# Altium project ATmega-ELVIS.PrjPcb
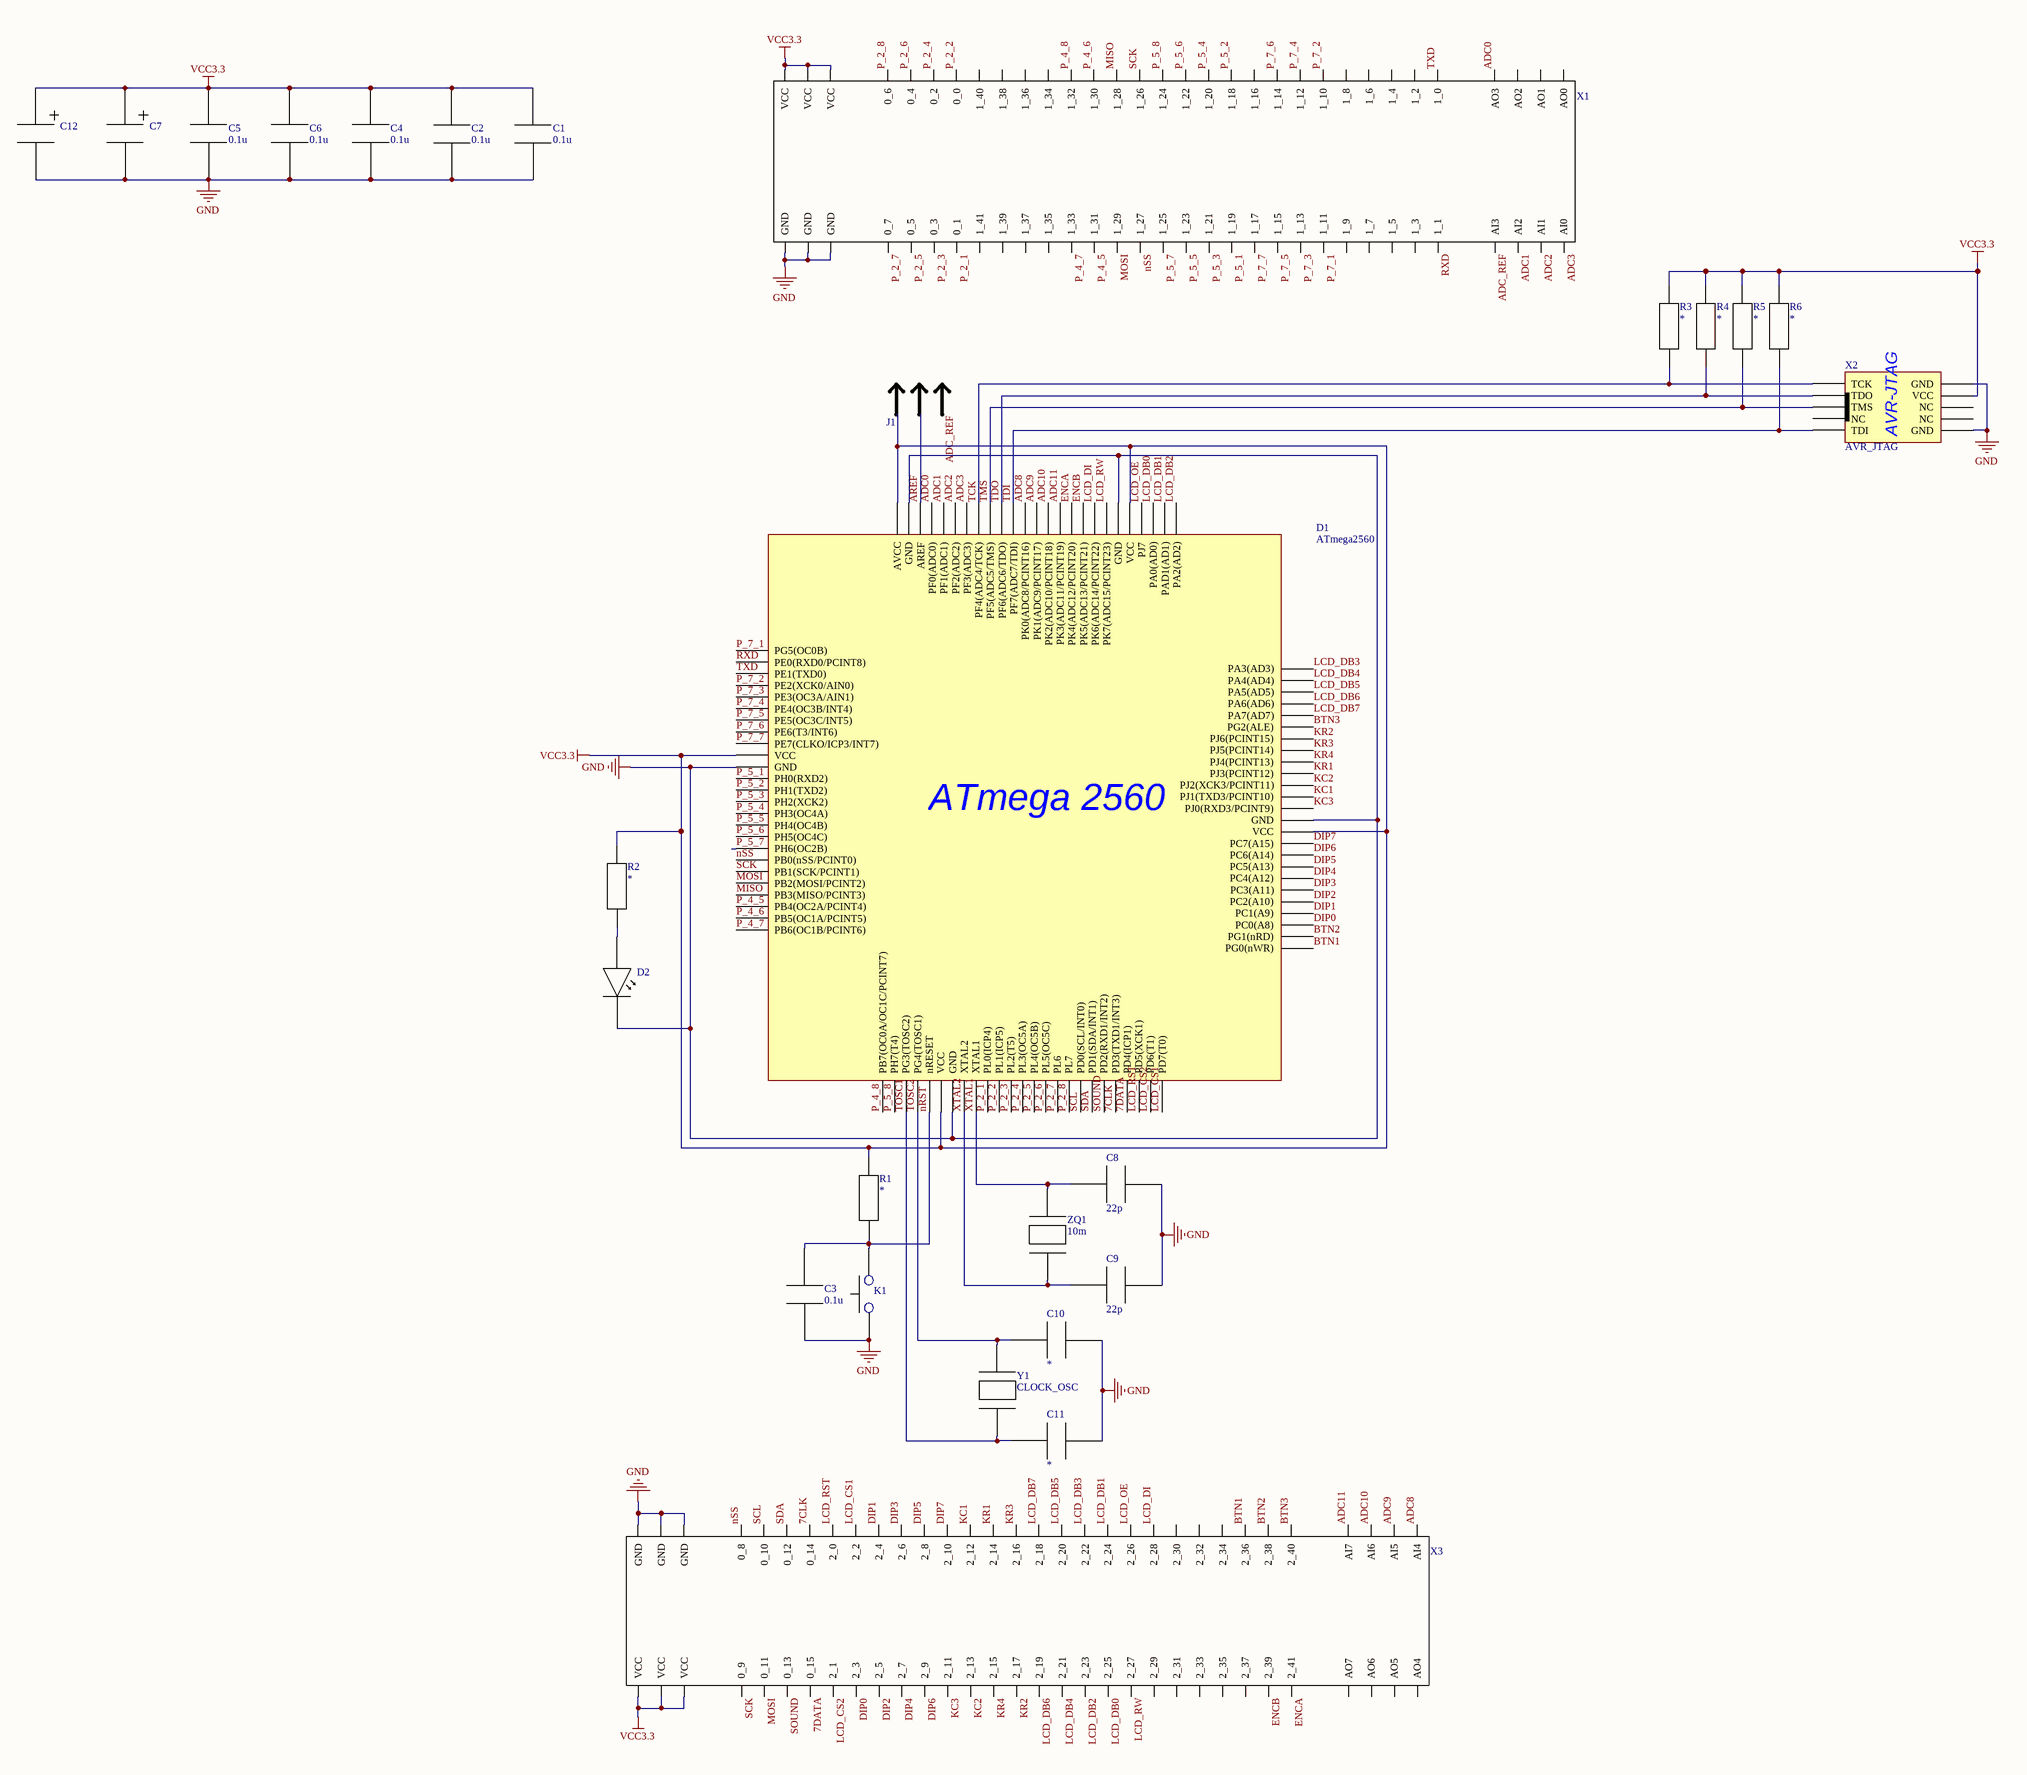
[diagram p0: main.SchDoc]
1 sheet, 27 parts. Net scope: global (net labels, ports and power ports of the same name join across sheets).
Board file: board.PcbDoc

## Sheet main.SchDoc
size A2

### Parts
C1  0.1u  [0805]
C2  0.1u  [0805]
C3  0.1u  [0805]
C4  0.1u  [0805]
C5  0.1u  [0805]
C6  0.1u  [0805]
C7  C_Ta  [C_Ta]  (value not drawn)
C8  22p  [0805]
C9  22p  [0805]
C10  *  [0805]
C11  *  [0805]
C12  C_Ta  [C_Ta]  (value not drawn)
D1  ATmega2560  [ATmega2560-16AU]
D2  LED0805  [0805]  (value not drawn)
J1  JUMPER_SWITCH_2S  [JUMPER_SWITCH_2S]  (value not drawn)
K1  SMD_BUTTON  [SMD_BUTTON]  (value not drawn)
R1  *  [0805]
R2  *  [0805]
R3  *  [0805]
R4  *  [0805]
R5  *  [0805]
R6  *  [0805]
X1  CONNECTOR_TOP  [Connector]  (value not drawn)
X2  AVR_JTAG  [JTAG_PLD]
X3  CONNECTOR_BOTTOM  [Connector]  (value not drawn)
Y1  CLOCK_OSC  [CLOCK_OSC]
ZQ1  10m  [XTAL]

### Nets
GND: C1.1 C2.1 C3.1 C4.2 C5.2 C6.2 C7.2 C8.1 C9.1 C10.1 C11.1 C12.2 D1.11(GND) D1.32(GND) D1.62(GND) D1.81(GND) D1.99(GND) D2.2 K1.1 X1.61(GND) X1.62(GND) X1.63(GND) X2.2(GND) X2.10(GND) X3.0(GND) X3.1(GND) X3.2(GND)
VCC3.3: C1.2 C2.2 C4.1 C5.1 C6.1 C7.1 C12.1 D1.10(VCC) D1.31(VCC) D1.61(VCC) D1.80(VCC) D1.100(AVCC) J1.1 R1.1 R2.1 R3.2 R4.2 R5.2 R6.2 X1.0(VCC) X1.1(VCC) X1.2(VCC) X2.4(VCC) X3.61(VCC) X3.62(VCC) X3.63(VCC)
7CLK: D1.46(PD3(TXD1/INT3)) X3.6(0_14)
7DATA: D1.47(PD4(ICP1)) X3.57(0_15)
ADC0: D1.97(PF0(ADC0)) X1.28(AO3)
ADC1: D1.96(PF1(ADC1)) X1.34(AI2)
ADC2: D1.95(PF2(ADC2)) X1.33(AI1)
ADC3: D1.94(PF3(ADC3)) X1.32(AI0)
ADC8: D1.89(PK0(ADC8/PCINT16)) X3.31(AI4)
ADC9: D1.88(PK1(ADC9/PCINT17)) X3.30(AI5)
ADC10: D1.87(PK2(ADC10/PCINT18)) X3.29(AI6)
ADC11: D1.86(PK3(ADC11/PCINT19)) X3.28(AI7)
ADC_REF: J1.2 X1.35(AI3)
AREF: D1.98(AREF) J1.0
BTN1: D1.51(PG0(nWR)) X3.25(2_36)
BTN2: D1.52(PG1(nRD)) X3.26(2_38)
BTN3: D1.70(PG2(ALE)) X3.27(2_40)
DIP0: D1.53(PC0(A8)) X3.55(2_3)
DIP1: D1.54(PC1(A9)) X3.9(2_4)
DIP2: D1.55(PC2(A10)) X3.54(2_5)
DIP3: D1.56(PC3(A11)) X3.10(2_6)
DIP4: D1.57(PC4(A12)) X3.53(2_7)
DIP5: D1.58(PC5(A13)) X3.11(2_8)
DIP6: D1.59(PC6(A14)) X3.52(2_9)
DIP7: D1.60(PC7(A15)) X3.12(2_10)
ENCA: D1.85(PK4(ADC12/PCINT20)) X3.36(2_41)
ENCB: D1.84(PK5(ADC13/PCINT21)) X3.37(2_39)
KC1: D1.64(PJ1(TXD3/PCINT10)) X3.13(2_12)
KC2: D1.65(PJ2(XCK3/PCINT11)) X3.50(2_13)
KC3: D1.63(PJ0(RXD3/PCINT9)) X3.51(2_11)
KR1: D1.66(PJ3(PCINT12)) X3.14(2_14)
KR2: D1.69(PJ6(PCINT15)) X3.48(2_17)
KR3: D1.68(PJ5(PCINT14)) X3.15(2_16)
KR4: D1.67(PJ4(PCINT13)) X3.49(2_15)
LCD_CS1: D1.50(PD7(T0)) X3.8(2_2)
LCD_CS2: D1.49(PD6(T1)) X3.56(2_1)
LCD_DB0: D1.78(PA0(AD0)) X3.44(2_25)
LCD_DB1: D1.77(PAD1(AD1)) X3.19(2_24)
LCD_DB2: D1.76(PA2(AD2)) X3.45(2_23)
LCD_DB3: D1.75(PA3(AD3)) X3.18(2_22)
LCD_DB4: D1.74(PA4(AD4)) X3.46(2_21)
LCD_DB5: D1.73(PA5(AD5)) X3.17(2_20)
LCD_DB6: D1.72(PA6(AD6)) X3.47(2_19)
LCD_DB7: D1.71(PA7(AD7)) X3.16(2_18)
LCD_DI: D1.83(PK6(ADC14/PCINT22)) X3.21(2_28)
LCD_OE: D1.79(PJ7) X3.20(2_26)
LCD_RST: D1.48(PD5(XCK1)) X3.7(2_0)
LCD_RW: D1.82(PK7(ADC15/PCINT23)) X3.43(2_27)
MISO: D1.22(PB3(MISO/PCINT3)) X1.13(1_28)
MOSI: D1.21(PB2(MOSI/PCINT2)) X1.50(1_29) X3.59(0_11)
nRST: C3.2 D1.30(nRESET) K1.2 R1.2
nSS: D1.19(PB0(nSS/PCINT0)) X1.49(1_27) X3.3(0_8)
P_2_1: D1.35(PL0(ICP4)) X1.57(0_1)
P_2_2: D1.36(PL1(ICP5)) X1.6(0_0)
P_2_3: D1.37(PL2(T5)) X1.58(0_3)
P_2_4: D1.38(PL3(OC5A)) X1.5(0_2)
P_2_5: D1.39(PL4(OC5B)) X1.59(0_5)
P_2_6: D1.40(PL5(OC5C)) X1.4(0_4)
P_2_7: D1.41(PL6) X1.60(0_7)
P_2_8: D1.42(PL7) X1.3(0_6)
P_4_5: D1.23(PB4(OC2A/PCINT4)) X1.51(1_31)
P_4_6: D1.24(PB5(OC1A/PCINT5)) X1.12(1_30)
P_4_7: D1.25(PB6(OC1B/PCINT6)) X1.52(1_33)
P_4_8: D1.26(PB7(OC0A/OC1C/PCINT7)) X1.11(1_32)
P_5_1: D1.12(PH0(RXD2)) X1.45(1_19)
P_5_2: D1.13(PH1(TXD2)) X1.18(1_18)
P_5_3: D1.14(PH2(XCK2)) X1.46(1_21)
P_5_4: D1.15(PH3(OC4A)) X1.17(1_20)
P_5_5: D1.16(PH4(OC4B)) X1.47(1_23)
P_5_6: D1.17(PH5(OC4C)) X1.16(1_22)
P_5_7: D1.18(PH6(OC2B)) X1.48(1_25)
P_5_8: D1.27(PH7(T4)) X1.15(1_24)
P_7_1: D1.1(PG5(OC0B)) X1.41(1_11)
P_7_2: D1.4(PE2(XCK0/AIN0)) X1.22(1_10)
P_7_3: D1.5(PE3(OC3A/AIN1)) X1.42(1_13)
P_7_4: D1.6(PE4(OC3B/INT4)) X1.21(1_12)
P_7_5: D1.7(PE5(OC3C/INT5)) X1.43(1_15)
P_7_6: D1.8(PE6(T3/INT6)) X1.20(1_14)
P_7_7: D1.9(PE7(CLKO/ICP3/INT7)) X1.44(1_17)
RXD: D1.2(PE0(RXD0/PCINT8)) X1.36(1_1)
SCK: D1.20(PB1(SCK/PCINT1)) X1.14(1_26) X3.60(0_9)
SCL: D1.43(PD0(SCL/INT0)) X3.4(0_10)
SDA: D1.44(PD1(SDA/INT1)) X3.5(0_12)
SOUND: D1.45(PD2(RXD1/INT2)) X3.58(0_13)
TCK: D1.93(PF4(ADC4/TCK)) R3.1 X2.1(TCK)
TDI: D1.90(PF7(ADC7/TDI)) R6.1 X2.9(TDI)
TDO: D1.91(PF6(ADC6/TDO)) R4.1 X2.3(TDO)
TMS: D1.92(PF5(ADC5/TMS)) R5.1 X2.5(TMS)
TOSC1: C11.2 D1.28(PG3(TOSC2)) Y1.2
TOSC2: C10.2 D1.29(PG4(TOSC1)) Y1.1
TXD: D1.3(PE1(TXD0)) X1.27(1_0)
XTAL1: C8.2 D1.34(XTAL1) ZQ1.2
XTAL2: C9.2 D1.33(XTAL2) ZQ1.1
NetD2_1: D2.1 R2.2

Not connected (* = marked no-connect by the designer): X1 7(1_40) 8(1_38) 9(1_36) 10(1_34) 19(1_16) 23(1_8) 24(1_6) 25(1_4) 26(1_2) 29(AO2) 30(AO1) 31(AO0) 37(1_3) 38(1_5) 39(1_7) 40(1_9) 53(1_35) 54(1_37) 55(1_39) 56(1_41); X2 6(NC) 7(NC) 8(NC); X3 22(2_30) 23(2_32) 24(2_34) 32(AO4) 33(AO5) 34(AO6) 35(AO7) 38(2_37) 39(2_35) 40(2_33) 41(2_31) 42(2_29)

### Notes on the sheet
- (in symbol ATmega2560) ATmega 2560
- (in symbol AVR_JTAG) AVR-JTAG

### Library data of the parts
C1-C6 C8-C11 = C0805: 0805 ceramic capacitor
  C1-C6: Capacity: 0.1u
  C8 C9: Capacity: 22p
  C10 C11: Capacity: *
C7 C12 = C_Ta: tantalum capacitor
  C7: capacity: *
J1 = JUMPER_SWITCH_2S: 2 state jumper switch
K1 = SMD_BUTTON: smd micro button
R1-R6 = R0805: 0805 resistor; Resistance: *
X1 = CONNECTOR_TOP: control board connector
X3 = CONNECTOR_BOTTOM: control board connector
Y1 = CLOCK_OSC: low speed external clock
ZQ1 = XTAL: Frequency: 10m